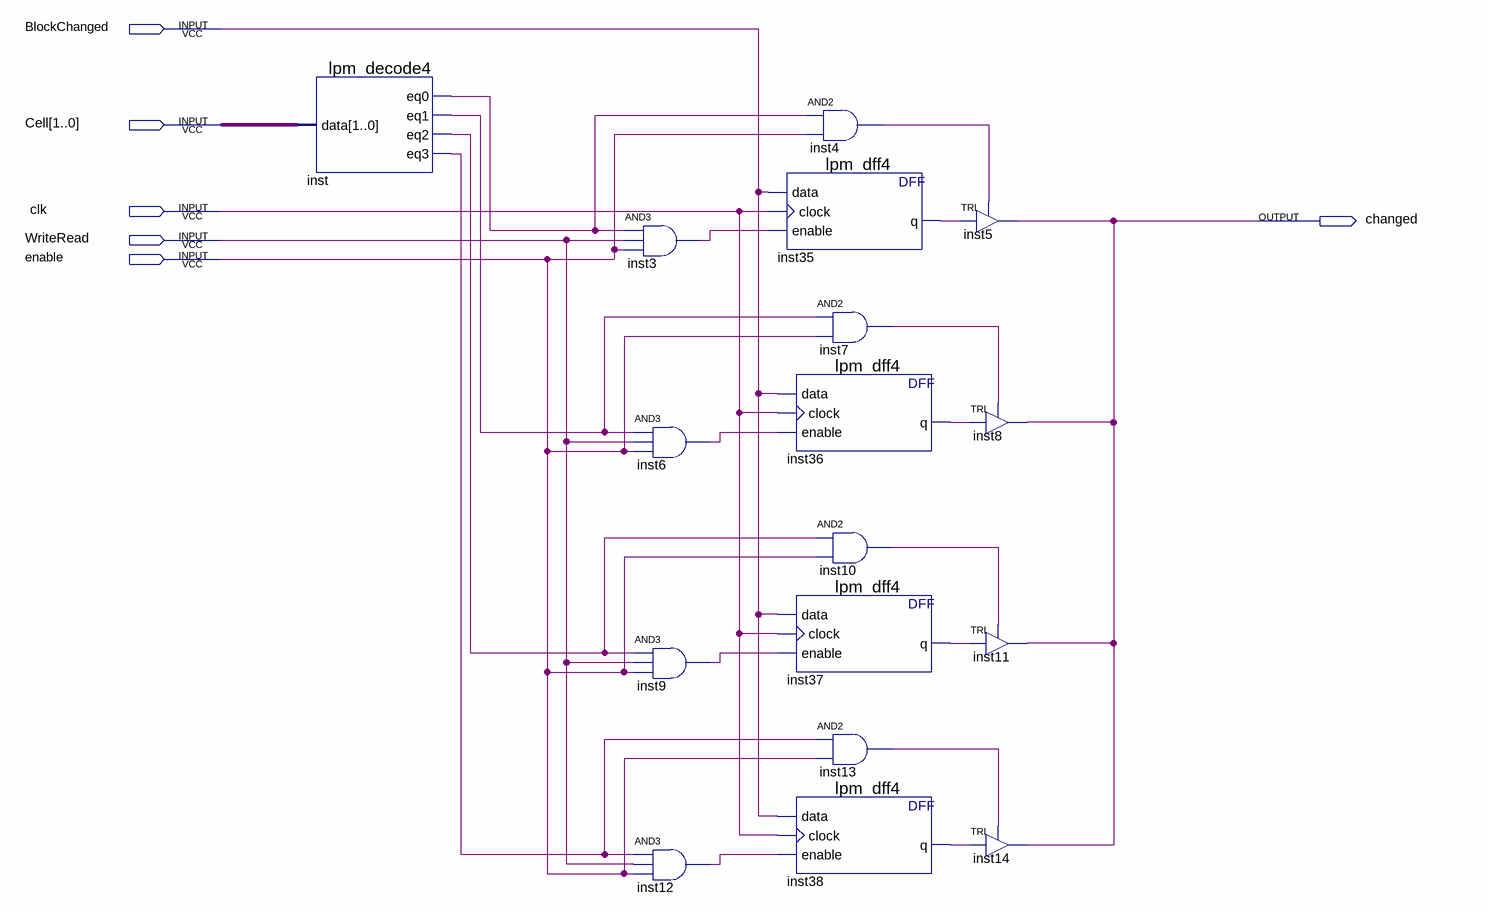
[diagram p0: schematic sheet]
// Quartus schematic FWString.bdf as structural Verilog: 17 symbols, 6 pins
module FWString (
  input  BlockChanged,
  input  [1:0] Cell,
  input  clk,
  input  WriteRead,
  input  enable,
  output changed
);

  wire inst3_out, inst4_out, inst6_out, inst7_out, inst9_out, inst10_out, inst12_out, inst13_out, inst35_q,
       inst36_q, inst37_q, inst38_q, inst_eq0, inst_eq1, inst_eq2, inst_eq3;

  lpm_decode4 inst (.data(Cell), .eq0(inst_eq0), .eq1(inst_eq1), .eq2(inst_eq2), .eq3(inst_eq3));
  and inst3 (inst3_out, inst_eq0, WriteRead, enable);
  and inst6 (inst6_out, inst_eq1, WriteRead, enable);
  and inst9 (inst9_out, inst_eq2, WriteRead, enable);
  and inst12 (inst12_out, inst_eq3, WriteRead, enable);
  lpm_dff4 inst35 (.data(BlockChanged), .clock(clk), .enable(inst3_out), .q(inst35_q));
  and inst4 (inst4_out, inst_eq0, enable);
  and inst7 (inst7_out, inst_eq1, enable);
  lpm_dff4 inst36 (.data(BlockChanged), .clock(clk), .enable(inst6_out), .q(inst36_q));
  and inst10 (inst10_out, inst_eq2, enable);
  lpm_dff4 inst37 (.data(BlockChanged), .clock(clk), .enable(inst9_out), .q(inst37_q));
  and inst13 (inst13_out, inst_eq3, enable);
  lpm_dff4 inst38 (.data(BlockChanged), .clock(clk), .enable(inst12_out), .q(inst38_q));
  TRI inst5 (.IN(inst35_q), .OE(inst4_out), .OUT(changed));
  TRI inst8 (.IN(inst36_q), .OE(inst7_out), .OUT(changed));
  TRI inst11 (.IN(inst37_q), .OE(inst10_out), .OUT(changed));
  TRI inst14 (.IN(inst38_q), .OE(inst13_out), .OUT(changed));
endmodule
